# EAGLE design power_board (EAGLE 9.5.2)
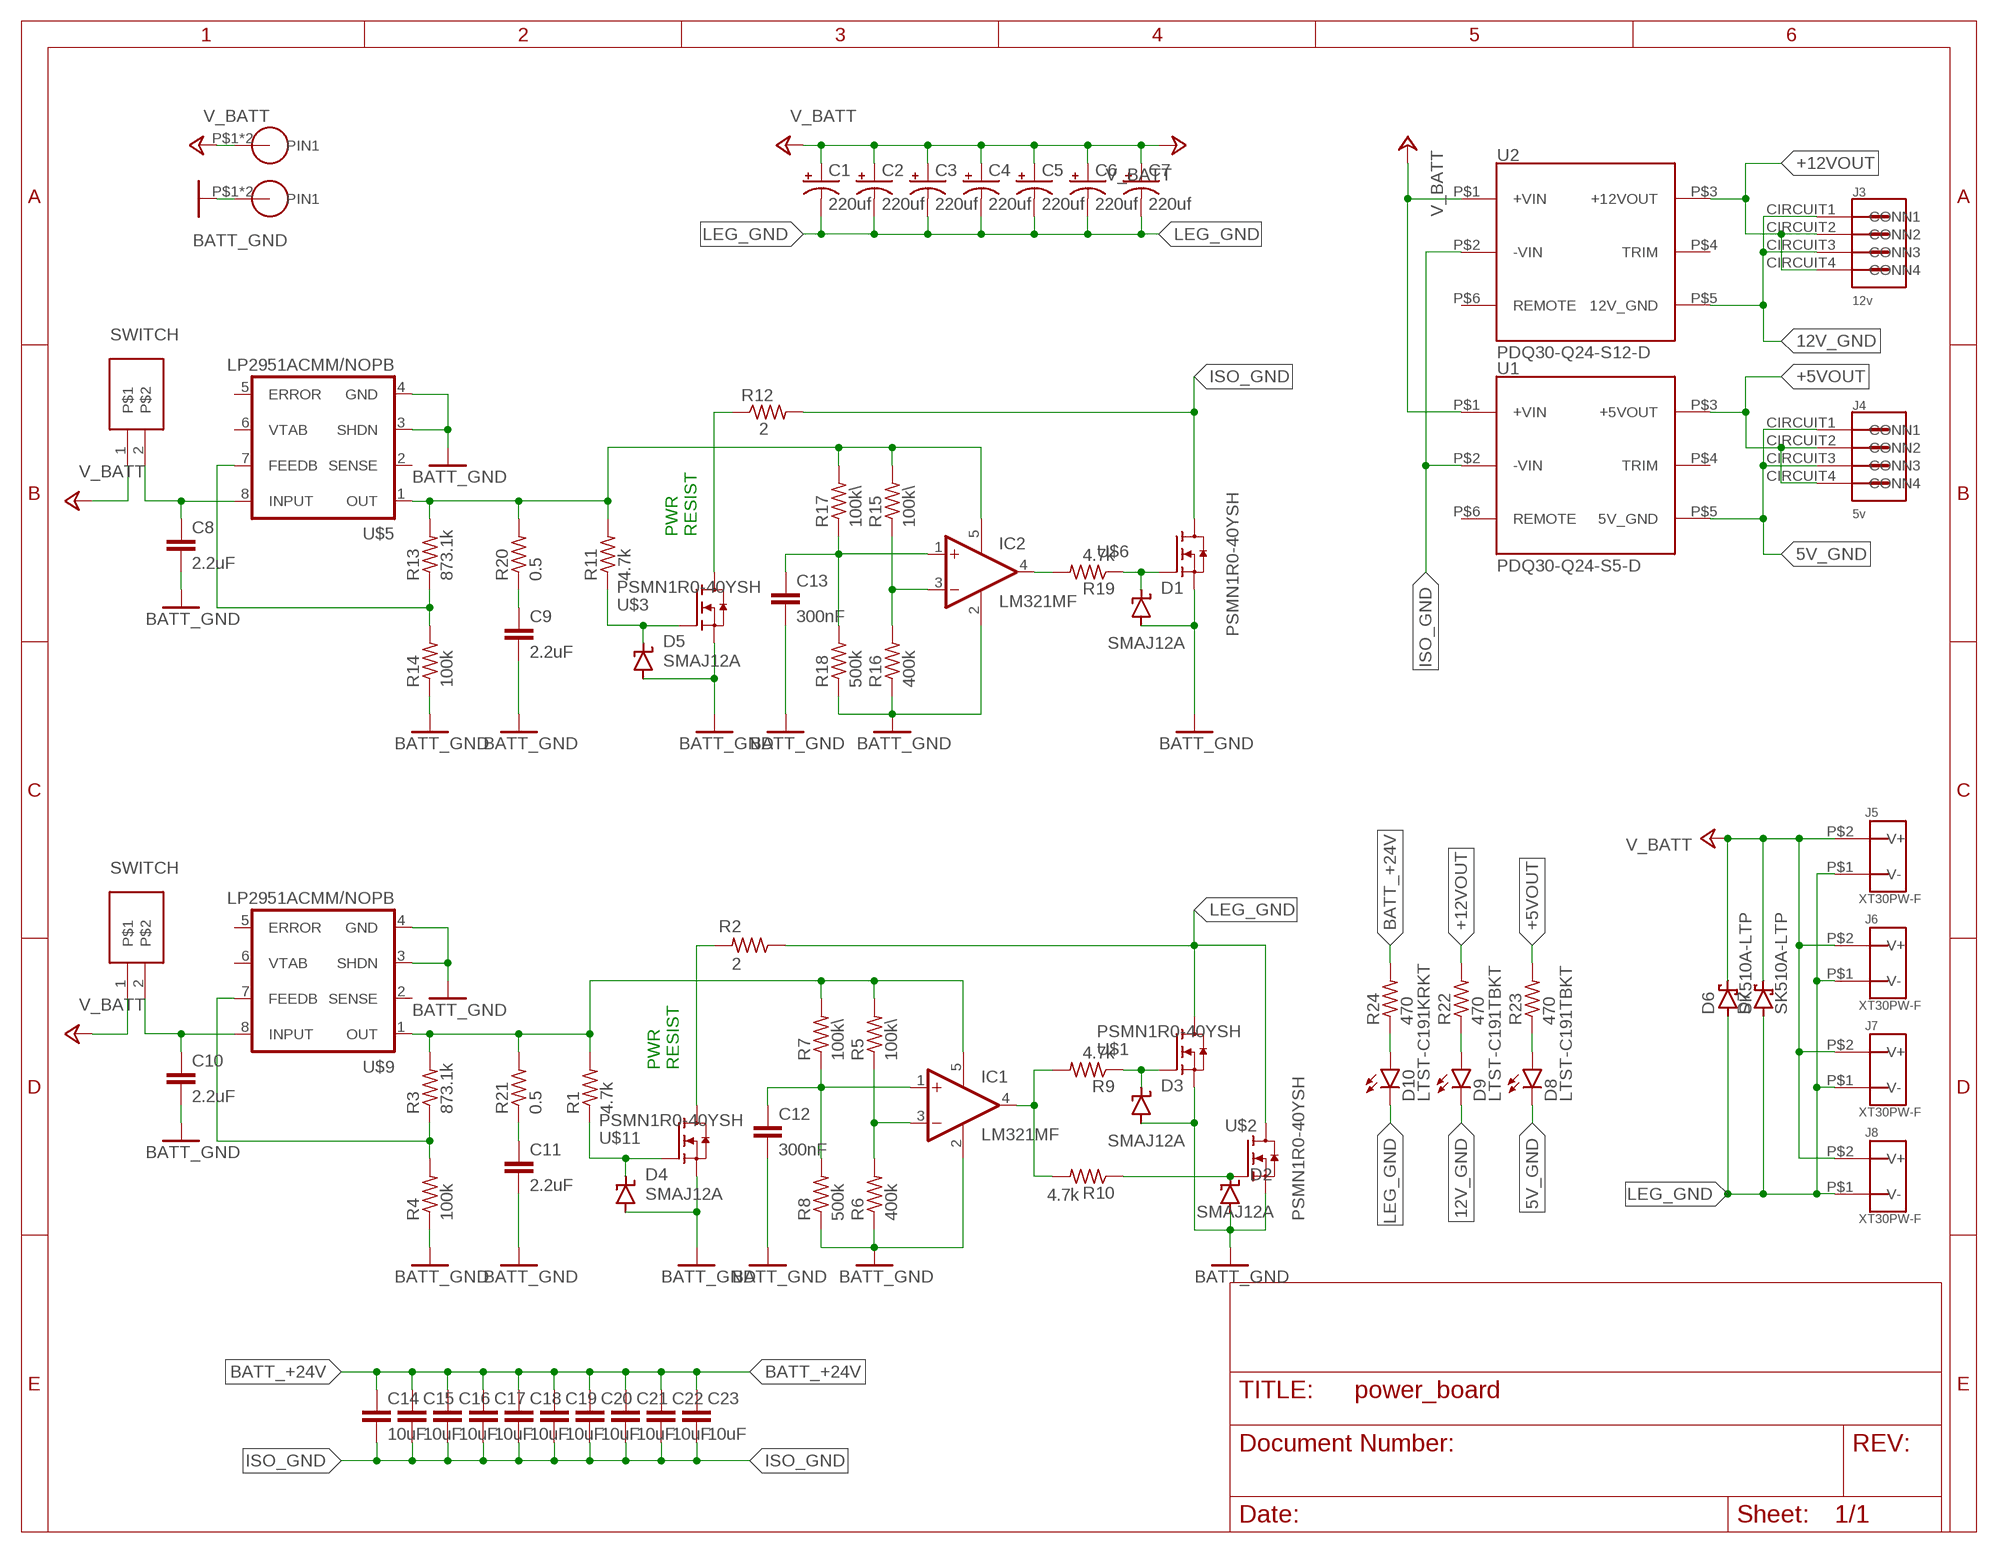
[diagram p0: schematic, sheet 1]

## Parts
C1  220uf  35ZLH220MEFC8X11.5  [C_ELEC_8X11_5]
C2  220uf  35ZLH220MEFC8X11.5  [C_ELEC_8X11_5]
C3  220uf  35ZLH220MEFC8X11.5  [C_ELEC_8X11_5]
C4  220uf  35ZLH220MEFC8X11.5  [C_ELEC_8X11_5]
C5  220uf  35ZLH220MEFC8X11.5  [C_ELEC_8X11_5]
C6  220uf  35ZLH220MEFC8X11.5  [C_ELEC_8X11_5]
C7  220uf  35ZLH220MEFC8X11.5  [C_ELEC_8X11_5]
C8  2.2uF  C_CERAMIC_0603  [C0603]
C9  2.2uF  C_CERAMIC_0603  [C0603]
C10  2.2uF  C_CERAMIC_0603  [C0603]
C11  2.2uF  C_CERAMIC_0603  [C0603]
C12  300nF  C_CERAMIC_0603  [C0603]
C13  300nF  C_CERAMIC_0603  [C0603]
C14  10uF  C_CERAMIC_1210  [C1210]
C15  10uF  C_CERAMIC_1210  [C1210]
C16  10uF  C_CERAMIC_1210  [C1210]
C17  10uF  C_CERAMIC_1210  [C1210]
C18  10uF  C_CERAMIC_1210  [C1210]
C19  10uF  C_CERAMIC_1210  [C1210]
C20  10uF  C_CERAMIC_1210  [C1210]
C21  10uF  C_CERAMIC_1210  [C1210]
C22  10uF  C_CERAMIC_1210  [C1210]
C23  10uF  C_CERAMIC_1210  [C1210]
D1  SMAJ12A  [DO-214AC]
D2  SMAJ12A  [DO-214AC]
D3  SMAJ12A  [DO-214AC]
D4  SMAJ12A  [DO-214AC]
D5  SMAJ12A  [DO-214AC]
D6  SK510A-LTP  [DO-214AC]
D7  SK510A-LTP  [DO-214AC]
D8  LTST-C191TBKT  [LTST-C191TBKT]
D9  LTST-C191TBKT  [LTST-C191TBKT]
D10  LTST-C191KRKT  [LTST-C191TBKT]
IC1  LM321MF  [SOT23-5]
IC2  LM321MF  [SOT23-5]
J1  FASTON1289_ST  [FASTON_1289-ST]
J2  FASTON1289_ST  [FASTON_1289-ST]
J3  12v  MOLEX_4_RA  [MOLEX_4_RA]
J4  5v  MOLEX_4_RA  [MOLEX_4_RA]
J5  XT30PW-F  [XT30PW-F]
J6  XT30PW-F  [XT30PW-F]
J7  XT30PW-F  [XT30PW-F]
J8  XT30PW-F  [XT30PW-F]
R1  4.7k  R-US_R0603  [R0603]
R2  2  PWR163  [PWR163]
R3  873.1k  R-US_R0603  [R0603]
R4  100k  R-US_R0603  [R0603]
R5  100k\  R-US_R0603  [R0603]
R6  400k  R-US_R0603  [R0603]
R7  100k\  R-US_R0603  [R0603]
R8  500k  R-US_R0603  [R0603]
R9  4.7k  R-US_R0603  [R0603]
R10  4.7k  R-US_R0603  [R0603]
R11  4.7k  R-US_R0603  [R0603]
R12  2  PWR163  [PWR163]
R13  873.1k  R-US_R0603  [R0603]
R14  100k  R-US_R0603  [R0603]
R15  100k\  R-US_R0603  [R0603]
R16  400k  R-US_R0603  [R0603]
R17  100k\  R-US_R0603  [R0603]
R18  500k  R-US_R0603  [R0603]
R19  4.7k  R-US_R0603  [R0603]
R20  0.5  R-US_R0603  [R0603]
R21  0.5  R-US_R0603  [R0603]
R22  470  R-US_R0603  [R0603]
R23  470  R-US_R0603  [R0603]
R24  470  R-US_R0603  [R0603]
U1  PDQ30-Q24-S5-D  [PDQ30-D]
U2  PDQ30-Q24-S12-D  [PDQ30-D]
U$1  PSMN1R0-40YSH  [LFPAK56E]
U$2  PSMN1R0-40YSH  [LFPAK56E]
U$3  PSMN1R0-40YSH  [LFPAK56E]
U$5  LP2951ACMM/NOPB  [LP2591]
U$6  PSMN1R0-40YSH  [LFPAK56E]
U$9  LP2951ACMM/NOPB  [LP2591]
U$11  PSMN1R0-40YSH  [LFPAK56E]
U$26  2-PIN  [M80-8420242]
U$27  2-PIN  [M80-8420242]

## Nets
5V_GND [power plane]: D8.C J4.CIRCUIT1(CONN1) J4.CIRCUIT3(CONN3) U1.P$5(5V_GND)
12V_GND [power plane]: D9.C J3.CIRCUIT1(CONN1) J3.CIRCUIT3(CONN3) U2.P$5(12V_GND)
+5VOUT [power plane]: J4.CIRCUIT2(CONN2) J4.CIRCUIT4(CONN4) R23.2 U1.P$3(+5VOUT)
+12VOUT [power plane]: J3.CIRCUIT2(CONN2) J3.CIRCUIT4(CONN4) R22.2 U2.P$3(+12VOUT)
BATT_+24V [power plane]: C1.1(+) C2.1(+) C3.1(+) C4.1(+) C5.1(+) C6.1(+) C7.1(+) C14.1 C15.1 C16.1 C17.1 C18.1 C19.1 C20.1 C21.1 C22.1 C23.1 D6.C D7.C J1.P$1(PIN1) J1.P$2(PIN1) J5.P$2(V+) J6.P$2(V+) J7.P$2(V+) J8.P$2(V+) R24.2 U1.P$1(+VIN) U2.P$1(+VIN) U$26.1 U$27.1 ; supply symbol labelled V_BATT
BATT_GND: C8.2 C9.2 C10.2 C11.2 C12.2 C13.2 D1.A D2.A D3.A D4.A D5.A IC1.2(V-) IC2.2(V-) J2.P$1(PIN1) J2.P$2(PIN1) R4.1 R6.1 R8.1 R14.1 R16.1 R18.1 U$1.1(S) U$1.2(S) U$1.3(S) U$2.1(S) U$2.2(S) U$2.3(S) U$3.1(S) U$3.2(S) U$3.3(S) U$5.3(SHDN) U$5.4(GND) U$6.1(S) U$6.2(S) U$6.3(S) U$9.3(SHDN) U$9.4(GND) U$11.1(S) U$11.2(S) U$11.3(S)
ISO_12V: IC2.5(V+) R11.2 R13.2 R15.2 R17.2 R20.2 U$5.1(OUT)
ISO_GND [power plane]: C14.2 C15.2 C16.2 C17.2 C18.2 C19.2 C20.2 C21.2 C22.2 C23.2 R12.P$2 U1.P$2(-VIN) U2.P$2(-VIN) U$6.5(D)
LEG_12V: IC1.5(V+) R1.2 R3.2 R5.2 R7.2 R21.2 U$9.1(OUT)
LEG_GND [power plane]: C1.2(-) C2.2(-) C3.2(-) C4.2(-) C5.2(-) C6.2(-) C7.2(-) D6.A D7.A D10.C J5.P$1(V-) J6.P$1(V-) J7.P$1(V-) J8.P$1(V-) R2.P$1 U$1.5(D) U$2.5(D)
N$1: R2.P$2 U$11.5(D)
N$2: D4.C R1.1 U$11.4(G)
N$3: R3.1 R4.2 U$9.7(FEEDB)
N$4: IC1.3(-IN) R5.1 R6.2
N$5: C12.1 IC1.1(+IN) R7.1 R8.2
N$6: IC1.4(OUT) R9.2 R10.2
N$7: D5.C R11.1 U$3.4(G)
N$8: D3.C R9.1 U$1.4(G)
N$9: D2.C R10.1 U$2.4(G)
N$10: R13.1 R14.2 U$5.7(FEEDB)
N$11 [power plane]: R12.P$1 U$3.5(D)
N$12: IC2.3(-IN) R15.1 R16.2
N$13: C13.1 IC2.1(+IN) R17.1 R18.2
N$14: IC2.4(OUT) R19.2
N$15: D1.C R19.1 U$6.4(G)
N$16: C9.1 R20.1
N$17: C11.1 R21.1
N$18: C8.1 U$5.8(INPUT) U$26.2
N$19: C10.1 U$9.8(INPUT) U$27.2
N$20: D9.A R22.1
N$21: D8.A R23.1
N$22: D10.A R24.1
Unconnected: U1.P$4(TRIM) U1.P$6(REMOTE) U2.P$4(TRIM) U2.P$6(REMOTE) U$5.2(SENSE) U$5.5(ERROR) U$5.6(VTAB) U$9.2(SENSE) U$9.5(ERROR) U$9.6(VTAB)

## Notes on the sheet
- SWITCH
- PWR
  RESIST
- SWITCH
- PWR
  RESIST

## Library data of the parts
C1-C7 = timlib:35ZLH220MEFC8X11.5
C8-C23 = timlib:C_CERAMIC
D1-D5 = timlib:SMAJ12A: 12V Schottkey Datasheet <https://www.littelfuse.com/~/media/electronics/datasheets/tvs_diodes/littelfuse_tvs_diode_smaj_datasheet.pdf.pdf>
D6 D7 = timlib:SK510A-LTP
D8-D10 = timlib:LTST-C19?*
IC1 IC2 = linear:LM321?*: Low Power Single Op Amp Source: http://cache.national.com/ds/LM/LM321.pdf
J1 J2 = timlib:FASTON
J3 J4 = timlib:MOLEX_4_RA: Molex 4 pin right angle 430450402 Datasheet <https://www.molex.com/pdm_docs/sd/430450402_sd.pdf>
J5-J8 = timlib:XT30PW-F
R1 R3-R11 R13-R24 = rcl:R-US_: RESISTOR, American symbol; SPICEPREFIX: R
R2 R12 = timlib:PWR163: PWR163 power resistor Datasheet <https://www.bourns.com/docs/Product-Datasheets/PWR163.pdf>
U1 = timlib:PDQ30-Q24-S5-D: PDQ30-Q24-S5-D Isolated 5v DC-DC supply Datasheet <https://www.cui.com/product/resource/pdq30-d.pdf>
U2 = timlib:PDQ30-Q24-S12-D: PDQ30-Q24-S12-D Isolated 12v DC-DC supply Datasheet <https://www.cui.com/product/resource/pdq30-d.pdf>
U$1-U$3 U$6 U$11 = timlib:PSMN1R0-40YSH: N-channel 40V 1mOhm 290A MOSFET Datasheet <https://assets.nexperia.com/documents/data-sheet/PSMN1R0-40YSH.pdf>
U$5 U$9 = timlib:LP2951ACMM/NOPB: 3.3-30V linear regulator Datasheet <http://www.ti.com/lit/gpn/lp2951>
U$26 U$27 = timlib:2-PIN

## Net classes
0 default: drill 0.3 mm
1 power plane: clearance 0.5 mm
2 power via: drill 0.25 mm, clearance 0.025 mm

## Board
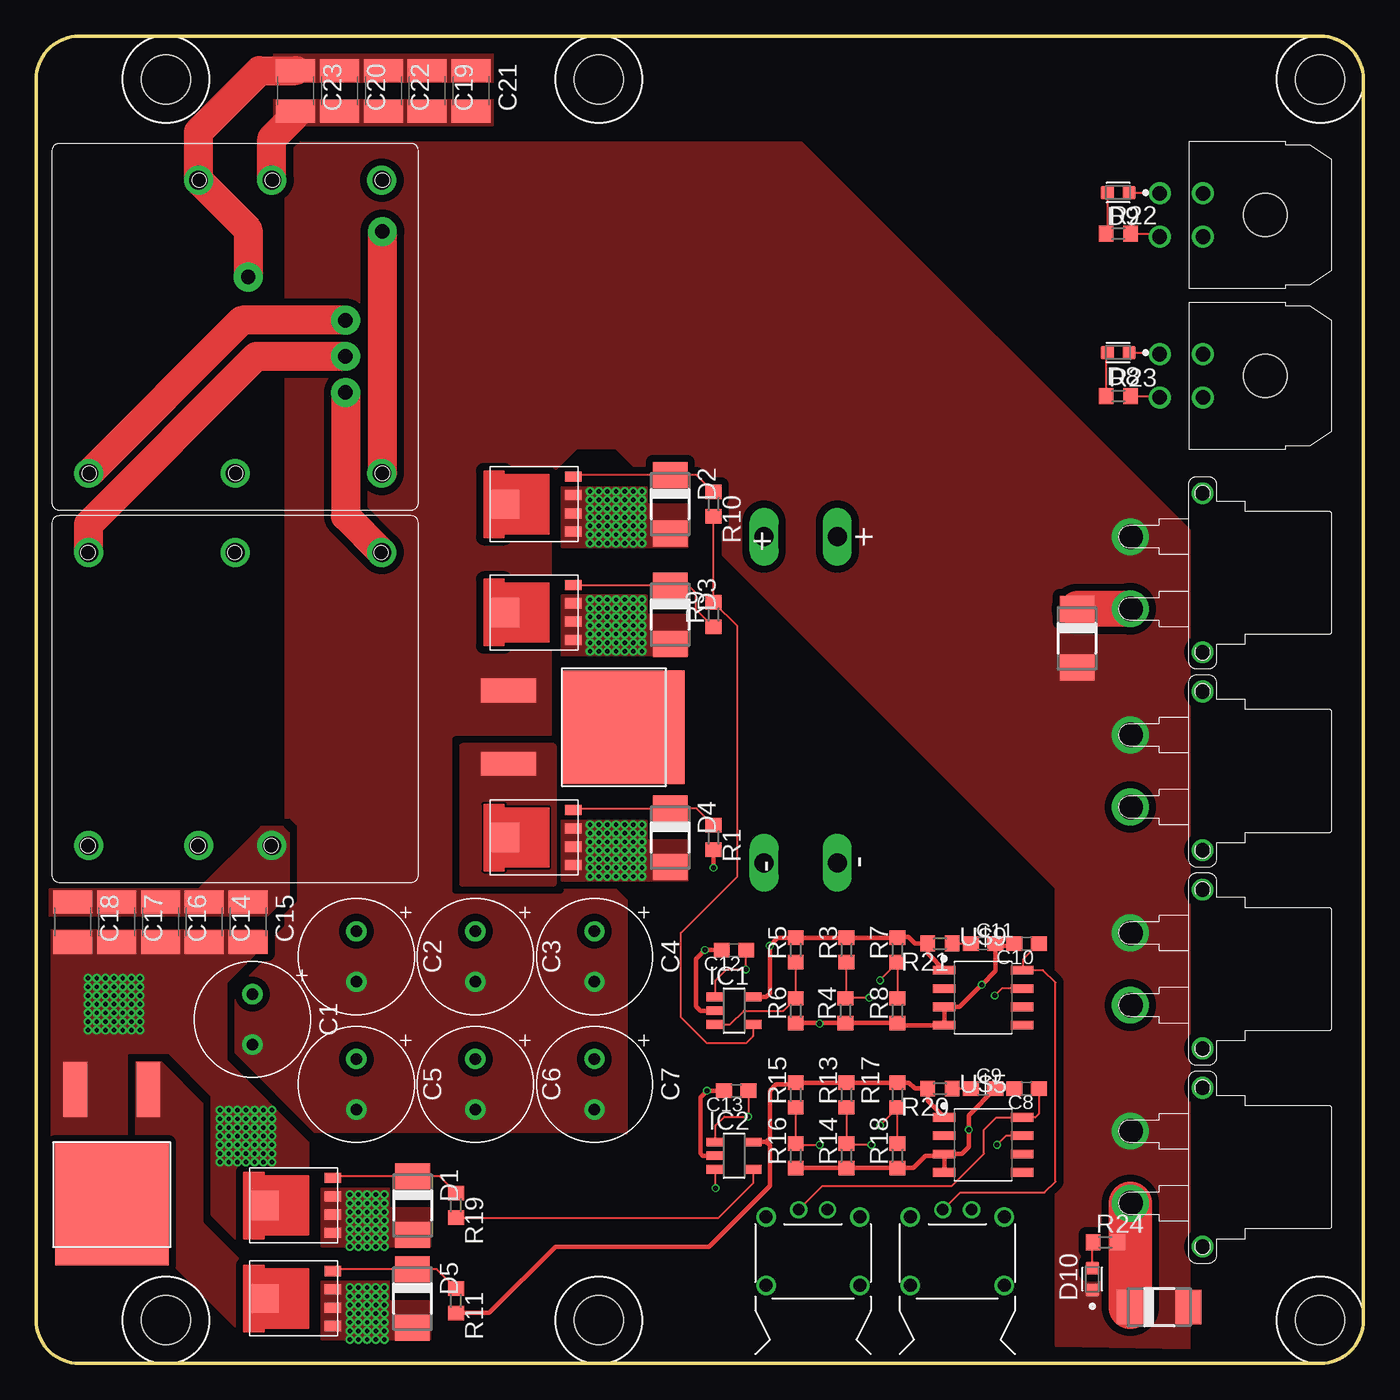
[diagram p1: board, top side]
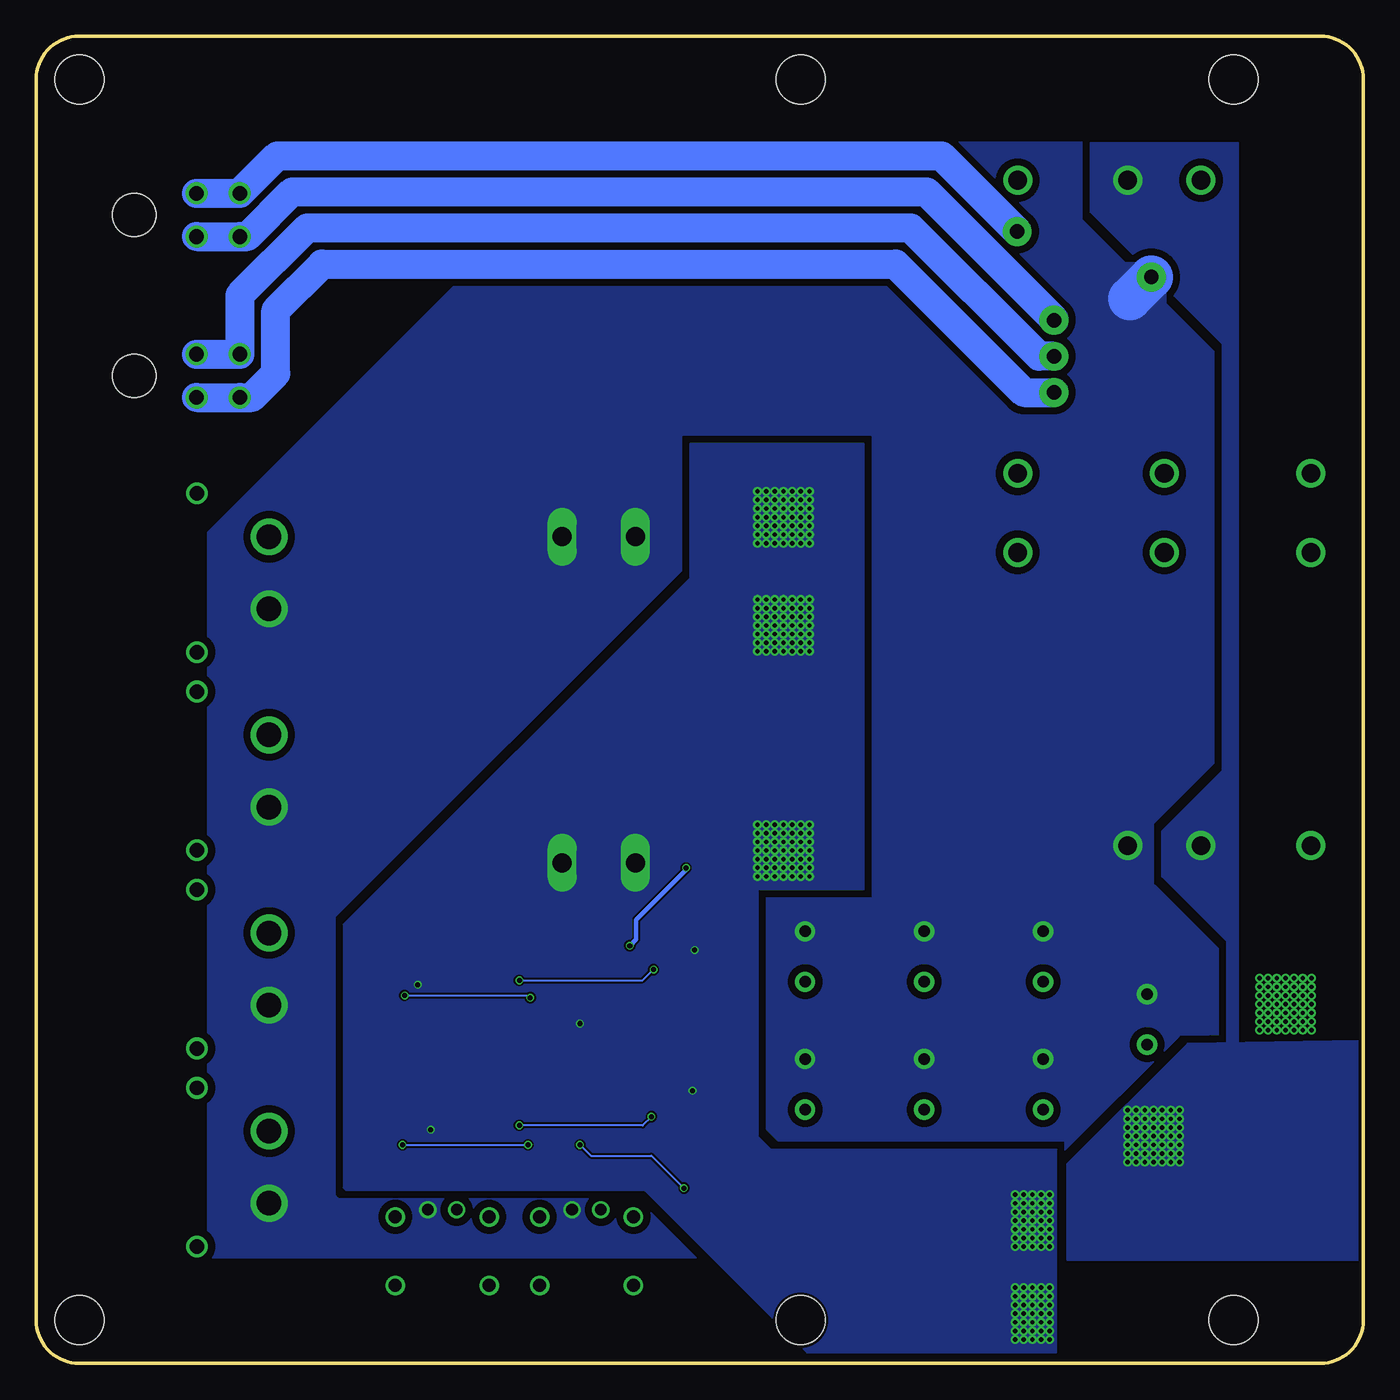
[diagram p2: board, bottom side, seen from below]

Size 92 x 92 mm. Coordinates in mm from the lower left corner, seen from the top.
Outline: 0,89 0,3 arc90 3,0 89,0 arc90 92,3 92,89 arc90 89,92 3,92 arc90 0,89
Copper layers (1*16): Top 0.035559375mm / dielectric 1.6mm / Bottom 0.035559375mm
Design rules "jlcpcb2layer *": minimum track width 5mil, minimum drill 0.3mm, track to track 5mil, track to pad 5mil, pad to pad 5mil, via to via 5mil, smd to smd 5mil, copper to edge 8mil, drill to drill 6mil, minimum pad ring 5mil, minimum via ring 3mil, stop-mask expansion 2.5mil, vias tented up to drill 0mil, thermal gap 10mil
Holes 3.4 mm at 39,89 9,89 9,3 39,3 89,3 89,89

### Footprints (pad centres in the part's own frame; a part is rotated, then mirrored left to right if it is on the bottom)
C_ELEC_8X11_5 = drill 0.8 pad 1.4: 1 -1.75,0; 2 1.75,0
C0603 = smd 1.1 x 1: 1 -0.85,0; 2 0.85,0
C1210 = smd 1.6 x 2.7: 1 -1.4,0; 2 1.4,0
DO-214AC = smd 1.8 x 2.4: A 2.025,0; C -2.025,0
LTST-C191TBKT = smd 0.91 x 0.93: A 0.76,0; C -0.76,0
SOT23-5 = smd 0.6 x 1.2: 1 -0.95,-1.306; 2 0,-1.306; 3 0.95,-1.306; 4 0.95,1.306; 5 -0.95,1.306
FASTON_1289-ST = drill 1.32 pad 2 long: P$1 -2.54,0; P$2 2.54,0
MOLEX_4_RA = drill 1.016: CIRCUIT1 1.5,4.32; CIRCUIT2 -1.5,4.318; CIRCUIT3 1.5,7.32; CIRCUIT4 -1.5,7.32 | hole 3: 0,0
XT30PW-F = drill 1.7: P$1 -2.5,-5; P$2 2.5,-5 | drill 1: P$3 5.5,0; P$4 -5.5,0
R0603 = smd 1 x 1.1: 1 -0.85,0; 2 0.85,0
PWR163 = smd 1.651 x 3.81: P$1 -2.54,-1.905; P$2 2.54,-1.905 | smd 7.874 x 8.509: TAB 0,6.032
PDQ30-D = drill 1.3 pad 2: P$1 -2.54,10.16; P$2 2.54,10.16; P$3 -10.16,-10.16; P$4 0,-10.16; P$5 10.16,-10.16; P$6 10.16,10.16
LFPAK56E = smd 0.7 x 1.15: 1 -1.905,-2.725; 2 -0.635,-2.725; 3 0.635,-2.725; 4 1.905,-2.725 | smd 2 x 2: 5 0,2.032
LP2591 = smd 1.55 x 0.6: 1 -2.7,1.905; 2 -2.7,0.635; 3 -2.7,-0.635; 4 -2.7,-1.905; 5 2.7,-1.905; 6 2.7,-0.635; 7 2.7,0.635; 8 2.7,1.905
M80-8420242 = drill 0.8: 1 1,0; 2 -1,0 | drill 0.9: P$4 3.25,-0.5; P$5 -3.25,-0.5; P$6 -3.25,-5.25; P$7 3.25,-5.25

### Placement (x,y rotation side)
C1  15,23.85 270 top
C2  22.2,28.2 270 top
C3  30.45,28.2 270 top
C4  38.7,28.2 270 top
C5  22.2,19.35 270 top
C6  30.45,19.35 270 top
C7  38.7,19.35 270 top
C8  68.65,19.05 180 top
C9  65.65,19.05 0 top
C10  68.65,29.1 180 top
C11  65.65,29.1 0 top
C12  48.38,28.65 180 top
C13  48.52,18.9 180 top
C14  11.66,30.6 270 top
C15  14.7,30.6 270 top
C16  8.62,30.6 270 top
C17  5.59,30.6 270 top
C18  2.55,30.6 270 top
C19  27.11,88.2 270 top
C20  21.04,88.2 270 top
C21  30.15,88.2 270 top
C22  24.07,88.2 270 top
C23  18,88.2 270 top
D1  26.1,10.95 270 top
D2  43.95,59.55 270 top
D3  43.95,51.9 270 top
D4  43.95,36.45 270 top
D5  26.08,4.5 270 top
D6  77.85,3.9 0 top
D7  72.15,50.25 270 top
D8  75,70.05 180 top
D9  75,81.15 180 top
D10  73.2,5.85 90 top
IC1  48.38,24.45 270 top
IC2  48.38,14.4 270 top
J1  53,57.3 0 bottom
J2  53,34.7 0 bottom
J3  85.2,79.6 90 top
J4  85.2,68.45 90 top
J5  80.85,27.33 270 top
J6  80.85,41.07 270 top
J7  80.85,54.8 270 top
J8  80.85,13.6 270 top
R1  46.95,36.45 270 top
R2  34.65,44.1 270 top
R3  56.17,28.65 90 top
R4  56.1,24.45 90 top
R5  52.65,28.65 90 top
R6  52.65,24.45 90 top
R7  59.7,28.65 90 top
R8  59.7,24.45 90 top
R9  46.95,51.9 90 top
R10  46.95,59.55 270 top
R11  29.1,4.35 270 top
R12  5.25,17.1 180 top
R13  56.17,18.6 90 top
R14  56.17,14.4 90 top
R15  52.65,18.6 90 top
R16  52.65,14.4 90 top
R17  59.7,18.6 90 top
R18  59.7,14.4 90 top
R19  29.1,10.95 270 top
R20  62.65,19.05 180 top
R21  62.65,29.1 180 top
R22  75,78.3 0 top
R23  75,67.05 0 top
R24  74.1,8.4 0 top
U1  13.8,46.05 180 top
U2  13.8,71.85 0 top
U$1  34.5,52.05 90 top
U$2  34.5,59.55 90 top
U$3  17.85,4.5 90 top
U$5  65.65,15.15 0 top
U$6  17.85,10.95 90 top
U$9  65.65,25.35 0 top
U$11  34.5,36.45 90 top
U$26  53.85,10.65 0 top
U$27  63.85,10.65 0 top

### Tracks (layer width: path | path; a pad name or v marks a point on that pad's centre or on a via)
5V_GND  (via drill 1 pad 2)
  Top 0.152: D8.C 77.78,70.05 J4.CIRCUIT3
  Top 2: U1.P$5 3.64,58.15 15.29,69.8 v21.45,69.8
  Bottom 2: v21.45,69.8 22.49,69.8 31.39,78.7 73.21,78.7 77.88,74.03 J4.CIRCUIT3 J4.CIRCUIT1
12V_GND  (via drill 1 pad 2)
  Top 0.152: D9.C 77.83,81.15 J3.CIRCUIT3
  Top 2: v24,78.45 24,61.73 U2.P$5
  Bottom 2: J3.CIRCUIT1 J3.CIRCUIT3 75.28,83.7 29.25,83.7 v24,78.45
+5VOUT  (via drill 1 pad 2)
  Top 0.152: R23.2 77.78,67.05 J4.CIRCUIT4
  Top 2: v21.45,67.3 21.45,58.72 U1.P$3
  Bottom 2: J4.CIRCUIT2 J4.CIRCUIT4 77.05,66.95 76.35,67.65 75.38,68.62 75.38,72.99 72.17,76.2 32.42,76.2 23.52,67.3 v21.45,67.3
+12VOUT  (via drill 1 pad 2)
  Top 0.152: R22.2 77.68,78.3 J3.CIRCUIT4
  Top 2: v21.45,72.3 14.25,72.3 U2.P$3
  Bottom 2: J3.CIRCUIT2 J3.CIRCUIT4 77.34,78.1 74.24,81.2 30.29,81.2 21.45,72.36 v21.45,72.3
BATT_+24V  (via drill 1 pad 2)
  Top 0.152: R24.2 74.95,10.2 J8.P$2
  Top 1.5: 75.85,3.9 D6.C
  Top 2: v14.7,75.3 14.7,78.57 U2.P$1 11.26,85.37 15.49,89.6 C23.1
  Top 2.5: J7.P$2 72.17,52.3 D7.C
  Top 3: J8.P$2 75.85,3.9
  Bottom 3: 16.2,73.8 v14.7,75.3
  pour Bottom (rank 4, no thermals): 9.75,84.6 53.1,84.6 80.1,57.6 80.1,7.35 9.75,7.35
  pour Top (no thermals): 16.5,90.75 31.65,90.75 31.65,88.8 16.5,88.8
  pour Top (no thermals): 0.9,31.05 16.05,31.05 17.55,32.55 17.55,36.75 17.1,37.2 15.6,37.2 11.25,32.85 0.9,32.85
BATT_GND  (via drill 0.3 pad 0.6, 0.35)
  Top 0.3: C13.2 v46.5,18.9 46.05,18.45 46.05,14.55 46.2,14.4 IC2.2 | C12.2 v46.36,28.65 45.75,28.04 45.75,24.75 46.05,24.45 IC1.2 | R6.1 54.25,23.6 v54.3,23.55 54.35,23.6 R4.1 R8.1 59.85,23.45 U$9.4 U$9.3 64,24.71 65.53,26.25 v65.55,26.25 66.5,27.2 66.5,28.95 | C11.2 66.5,28.95 | C10.2 67.65,28.95 66.5,28.95 | C8.2 C9.2 64.65,17.2 v64.65,16.2 64.65,15 64.17,14.52 U$5.3 62.95,14.4 | U$5.4 62.95,14.4 | 62.95,14.4 61.65,14.4 60.8,13.55 R18.1 R14.1 R16.1
  other vias: 38.4,52.95 39,52.95 39.6,52.95 40.2,52.95 40.8,52.95 41.4,52.95 42,52.95 42,52.35 41.4,52.35 40.8,52.35 40.2,52.35 39.6,52.35 39,52.35 38.4,52.35 38.4,51.75 39,51.75 39.6,51.75 40.2,51.75 40.8,51.75 41.4,51.75 42,51.75 42,51.15 41.4,51.15 40.8,51.15 40.2,51.15 39.6,51.15 39,51.15 38.4,51.15 38.4,50.55 39,50.55 39.6,50.55 40.2,50.55 40.8,50.55 41.4,50.55 42,50.55 42,49.95 41.4,49.95 40.8,49.95 40.2,49.95 39.6,49.95 39,49.95 38.4,49.95 38.4,49.35 39,49.35 39.6,49.35 40.2,49.35 40.8,49.35 41.4,49.35 42,49.35 21.75,8.1 21.75,8.7 21.75,9.3 21.75,9.9 21.75,10.5 21.75,11.1 21.75,11.7 22.35,11.7 22.35,11.1 22.35,10.5 22.35,9.9 22.35,9.3 22.35,8.7 22.35,8.1 22.95,8.1 22.95,8.7 22.95,9.3 22.95,9.9 22.95,10.5 22.95,11.1 22.95,11.7 23.55,11.7 23.55,11.1 23.55,10.5 23.55,9.9 23.55,9.3 23.55,8.7 23.55,8.1 24.15,8.1 24.15,8.7 24.15,9.3 24.15,9.9 24.15,10.5 24.15,11.1 24.15,11.7 21.75,1.65 21.75,2.25 21.75,2.85 21.75,3.45 21.75,4.05 21.75,4.65 21.75,5.25 22.35,5.25 22.35,4.65 22.35,4.05 22.35,3.45 22.35,2.85 22.35,2.25 22.35,1.65 22.95,1.65 22.95,2.25 22.95,2.85 22.95,3.45 22.95,4.05 22.95,4.65 22.95,5.25 23.55,5.25 23.55,4.65 23.55,4.05 23.55,3.45 23.55,2.85 23.55,2.25 23.55,1.65 24.15,1.65 24.15,2.25 24.15,2.85 24.15,3.45 24.15,4.05 24.15,4.65 24.15,5.25 38.4,37.35 39,37.35 39.6,37.35 40.2,37.35 40.8,37.35 41.4,37.35 42,37.35 42,36.75 41.4,36.75 40.8,36.75 40.2,36.75 39.6,36.75 39,36.75 38.4,36.75 38.4,36.15 39,36.15 39.6,36.15 40.2,36.15 40.8,36.15 41.4,36.15 42,36.15 42,35.55 41.4,35.55 40.8,35.55 40.2,35.55 39.6,35.55 39,35.55 38.4,35.55 38.4,34.95 39,34.95 39.6,34.95 40.2,34.95 40.8,34.95 41.4,34.95 42,34.95 42,34.35 41.4,34.35 40.8,34.35 40.2,34.35 39.6,34.35 39,34.35 38.4,34.35 38.4,33.75 39,33.75 39.6,33.75 40.2,33.75 40.8,33.75 41.4,33.75 42,33.75 38.4,60.45 39,60.45 39.6,60.45 40.2,60.45 40.8,60.45 41.4,60.45 42,60.45 42,59.85 41.4,59.85 40.8,59.85 40.2,59.85 39.6,59.85 39,59.85 38.4,59.85 38.4,59.25 39,59.25 39.6,59.25 40.2,59.25 40.8,59.25 41.4,59.25 42,59.25 42,58.65 41.4,58.65 40.8,58.65 40.2,58.65 39.6,58.65 39,58.65 38.4,58.65 38.4,58.05 39,58.05 39.6,58.05 40.2,58.05 40.8,58.05 41.4,58.05 42,58.05 42,57.45 41.4,57.45 40.8,57.45 40.2,57.45 39.6,57.45 39,57.45 38.4,57.45 38.4,56.85 39,56.85 39.6,56.85 40.2,56.85 40.8,56.85 41.4,56.85 42,56.85
  pour Top (no thermals): 36.45,53.25 42.3,53.25 42.3,51.9 45.15,51.9 45.15,49.05 36.45,49.05
  pour Top (no thermals): 19.8,12.15 24.45,12.15 24.45,10.8 27.3,10.8 27.3,8.1 19.8,8.1
  pour Top (no thermals): 19.8,5.7 24.45,5.7 24.45,4.35 27.3,4.35 27.3,1.65 19.8,1.65
  pour Top (no thermals): 36.45,37.65 42.3,37.65 42.3,36.3 45.15,36.3 45.15,33.45 36.45,33.45
  pour Top (no thermals): 36.45,60.75 42.3,60.75 42.3,59.55 45.15,59.55 45.15,56.55 36.45,56.55
  pour Bottom: 21.3,0.75 38.55,0.75 49.8,12 70.5,12 70.65,12.15 70.65,30.45 46.65,54.45 46.65,63.75 34.65,63.75 34.65,32.85 42,32.85 42,15.75 41.1,14.85 21.3,14.85
ISO_12V
  Top 0.3: R11.2 31.4,3.5 36,8.1 46.65,8.1 50.85,12.3 50.85,15.1 50.6,15.35 | U$5.1 61.8,18.2 R20.2 60.9,19.05 60.5,19.45 R17.2 R13.2 R15.2 52.55,19.35 51.3,19.35 50.85,18.9 50.85,15.6 50.6,15.35 | 50.6,15.35 IC2.5
ISO_GND  (via drill 0.3 pad 0.6)
  Top 2: U2.P$2 16.34,84.89 18,86.55
  other vias: 3.6,26.7 4.2,26.7 4.8,26.7 5.4,26.7 6,26.7 6.6,26.7 7.2,26.7 7.2,26.1 6.6,26.1 6,26.1 5.4,26.1 4.8,26.1 4.2,26.1 3.6,26.1 3.6,25.5 4.2,25.5 4.8,25.5 5.4,25.5 6,25.5 6.6,25.5 7.2,25.5 7.2,24.9 6.6,24.9 6,24.9 5.4,24.9 4.8,24.9 4.2,24.9 3.6,24.9 3.6,24.3 4.2,24.3 4.8,24.3 5.4,24.3 6,24.3 6.6,24.3 7.2,24.3 7.2,23.7 6.6,23.7 6,23.7 5.4,23.7 4.8,23.7 4.2,23.7 3.6,23.7 3.6,23.1 4.2,23.1 4.8,23.1 5.4,23.1 6,23.1 6.6,23.1 7.2,23.1 12.75,17.55 13.35,17.55 13.95,17.55 14.55,17.55 15.15,17.55 15.75,17.55 16.35,17.55 16.35,16.95 15.75,16.95 15.15,16.95 14.55,16.95 13.95,16.95 13.35,16.95 12.75,16.95 12.75,16.35 13.35,16.35 13.95,16.35 14.55,16.35 15.15,16.35 15.75,16.35 16.35,16.35 16.35,15.75 15.75,15.75 15.15,15.75 14.55,15.75 13.95,15.75 13.35,15.75 12.75,15.75 12.75,15.15 13.35,15.15 13.95,15.15 14.55,15.15 15.15,15.15 15.75,15.15 16.35,15.15 16.35,14.55 15.75,14.55 15.15,14.55 14.55,14.55 13.95,14.55 13.35,14.55 12.75,14.55 12.75,13.95 13.35,13.95 13.95,13.95 14.55,13.95 15.15,13.95 15.75,13.95 16.35,13.95
  pour Top (rank 2, no thermals): 18.9,8.55 18.9,15.3 13.2,21 13.2,26.4 15.3,28.5 15.75,28.5 15.75,30 1.05,30 1.05,8.7
  pour Top (no thermals): 16.5,87.6 31.65,87.6 31.65,85.8 16.5,85.8
  pour Bottom: 8.7,21.45 9.45,22.2 9.45,29.25 13.95,33.75 13.95,36.9 9.75,41.1 9.75,70.65 18.9,79.8 18.9,84.6 8.7,84.6
  pour Bottom (rank 2, no thermals): 12.19,22.16 20.55,13.8 20.55,7.2 0.15,7.2 0,7.35 0,22.2 0.15,22.35
LEG_12V  (via drill 0.35)
  Top 0.3: U$9.1 61.8,28.41 R21.2 60.9,29.1 60.45,29.55 59.75,29.55 R7.2 R3.2 R5.2 51.4,29.5 v50.85,28.95 50.85,25.65 50.6,25.4 IC1.5 | R1.2 v46.95,34.35
  Bottom 0.3: v46.95,34.35 46.95,34.2 50.4,30.75 50.4,29.4 v50.85,28.95
LEG_GND
  pour Top (rank 4, no thermals): 79.95,1.05 79.95,57.75 53.1,84.6 17.25,84.6 17.25,30.3 13.35,26.4 13.35,16.05 40.8,16.05 40.95,15.9 40.95,32.1 40.2,32.85 35.7,32.85 35.7,61.65 37.5,63.45 40.15,63.45 70.65,32.95 70.65,1.23
N$1
  pour Top: 29.55,42.75 29.55,33.3 35.85,33.3 35.85,42.75
N$2
  Top 0.152: U$11.4 37.34,38.48 D4.C 45.77,38.48 R1.1
N$3  (via drill 0.35)
  Top 0.152: U$9.7 66.94,25.98 v66.45,25.5 | v57.75,25.35 56.15,25.35 R4.2 56.17,25.38 R3.1
  Bottom 0.152: v66.45,25.5 57.9,25.5 v57.75,25.35
N$4
  Top 0.152: IC1.3 48.1,23.5 49.05,24.45 51.8,24.45 R6.2 R5.1
N$5  (via drill 0.35)
  Top 0.152: R8.2 R7.1 58.5,26.6 v58.5,26.55 | C12.1 49.2,28.62 v49.2,27.3 47.85,27.3 47.1,26.55 47.1,25.43 IC1.1
  Bottom 0.152: v58.5,26.55 49.95,26.55 v49.2,27.3
N$6
  Top 0.152: R10.2 R9.2 48.6,51.1 48.6,33.75 44.7,29.85 44.7,24 46.5,22.2 49.2,22.2 49.68,22.68 IC1.4
N$7
  Top 0.152: R11.1 27.77,6.53 D5.C 20.7,6.53 U$3.4
N$8
  Top 0.152: U$1.4 37.26,53.92 D3.C 45.23,53.92 45.75,53.4 45.75,52.25 R9.1
N$9
  Top 0.152: U$2.4 37.34,61.58 D2.C 45.77,61.58 R10.1
N$10  (via drill 0.35)
  Top 0.152: R13.1 R14.2 56.27,15.15 v57.9,15.15 | U$5.7 67.23,15.79 v66.6,15.15
  Bottom 0.152: v66.6,15.15 v57.9,15.15
N$11
  pour Top: 6.9,20.85 6.9,9.45 14.4,1.95 18.9,1.95 19.05,2.1 19.05,6.75 18.9,6.9 14.4,6.9 11.55,9.75 11.55,18 8.7,20.85
N$12  (via drill 0.35)
  Top 0.152: v54.3,15.15 52.75,15.15 R16.2 R15.1 | v47.1,12.15 47.1,13.42 IC2.3
  Bottom 0.152: v54.3,15.15 53.55,14.4 49.35,14.4 v47.1,12.15
N$13  (via drill 0.35)
  Top 0.152: C13.1 49.38,17.12 v49.35,17.1 47.7,17.1 47.1,16.5 47.1,15.38 IC2.1 | R18.2 R17.1 59.7,17.7 v58.5,16.5
  Bottom 0.152: v49.35,17.1 49.95,16.5 v58.5,16.5
N$14
  Top 0.152: IC2.4 49.68,12.48 47.3,10.1 R19.2
N$15
  Top 0.152: R19.1 29.1,11.85 27.98,12.97 D1.C 20.7,12.97 U$6.4
N$16
  Top 0.152: R20.1 C9.1
N$17
  Top 0.152: R21.1 C11.1
N$18
  Top 0.152: U$26.2 54.5,12.3 63.47,12.3 65.7,14.53 65.7,16.2 66.56,17.05 U$5.8 69.25,17.05 69.5,17.3 C8.1
N$19
  Top 0.152: U$27.2 64.05,11.85 69.9,11.85 70.65,12.6 70.65,26.4 69.8,27.25 68.4,27.25 | 68.4,27.25 U$9.8 | C10.1 68.4,28 68.4,27.25
N$20
  Top 0.152: D9.A 74.24,78.39 R22.1
N$21
  Top 0.152: D8.A 74.15,69.96 R23.1
N$22
  Top 0.152: D10.A 73.2,8.35 R24.1

### Text on the board
tPlace: + | + | - | -